# EAGLE design zgrzewarka3 - do szkoły (EAGLE 9.2.0)
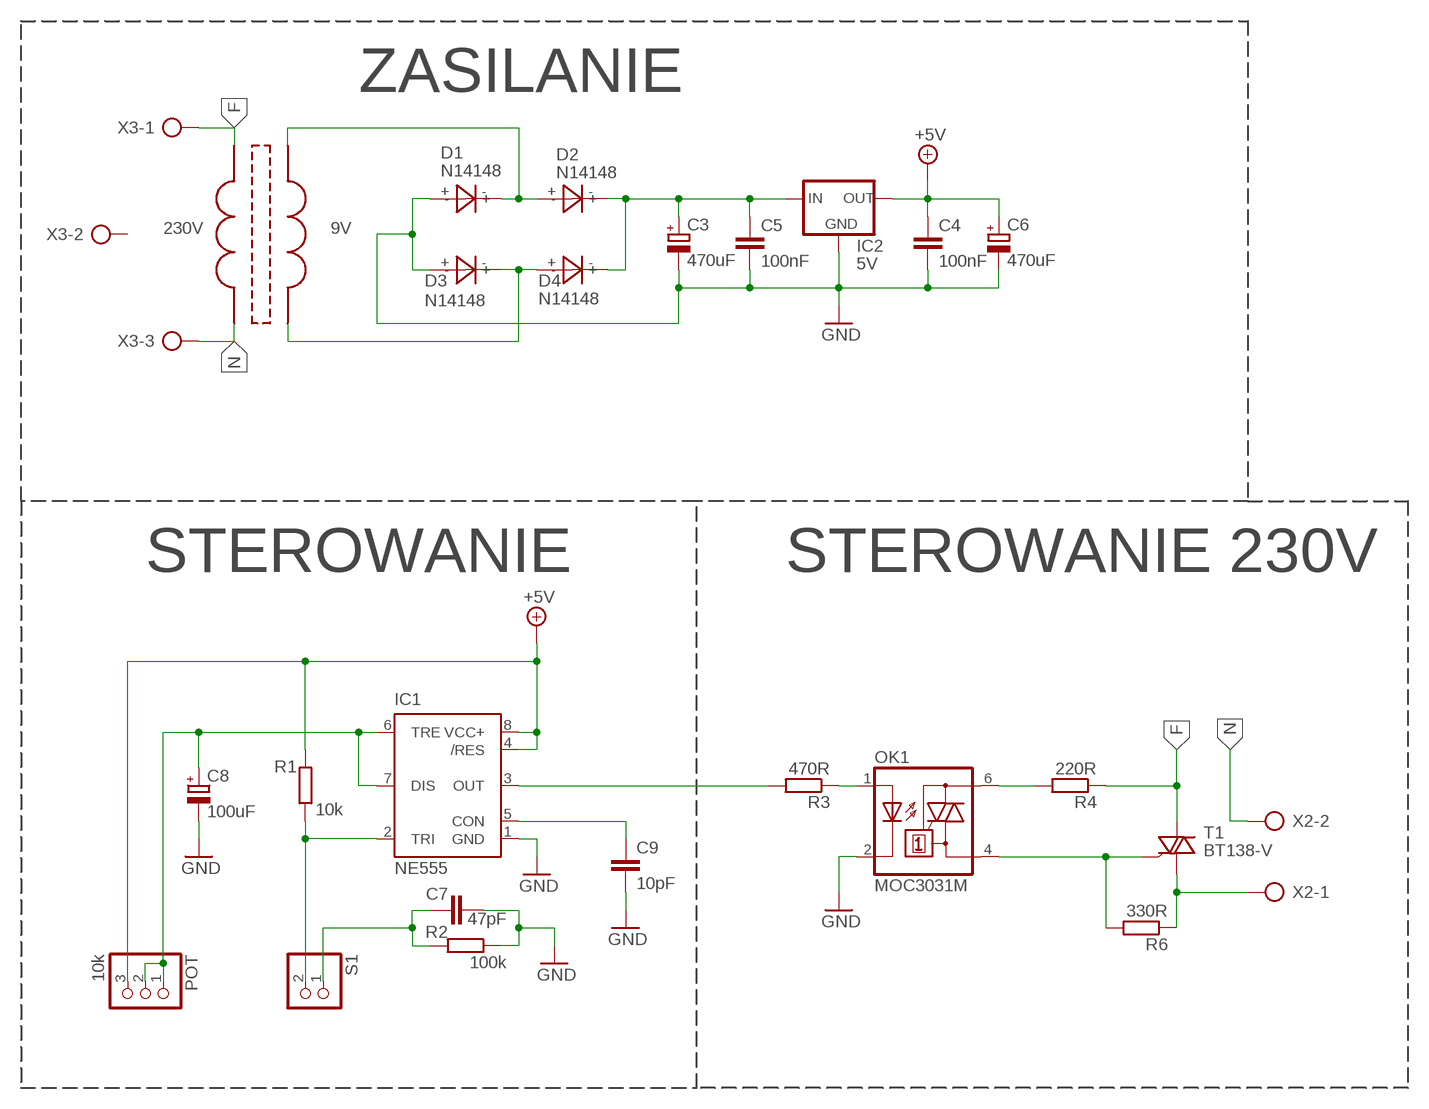
[diagram p0: schematic, sheet 1]

## Parts
C3  470uF  C-EU-POL'''  [C5-8,5]
C4  100nF  C-EU050-045-075  [C50-45-75]
C5  100nF  C-EU050-045-075  [C50-45-75]
C6  470uF  C-EU-POL'''  [C5-8,5]
C7  47pF  C-EU050-045-075  [C50-45-75]
C8  100uF  C-EU-POL'''  [C5-8,5]
C9  10pF  C-EU050-045-075  [C50-45-75]
D1  N14148  [DO35-7]
D2  N14148  [DO35-7]
D3  N14148  [DO35-7]
D4  N14148  [DO35-7]
IC1  NE555  [DIL-08]
IC2  5V  78LXX  [78LXX]
OK1  MOC3031M  [DIL06]
POT  10k  PINHD-1X3  [1X03]
R1  10k  R-EU7  [204/7]
R2  100k  R-EU7  [204/7]
R3  470R  R-EU7  [204/7]
R4  220R  R-EU7  [204/7]
R6  330R  R-EU7  [204/7]
S1  PINHD-1X2  [1X02]
T1  BT138-V  [TO220BV]
U$1  TRAFO-9V  [OBUDOWA1]
X2  AK300/2  [AK300/2]
X3  AK300/3  [AK300/3]

## Nets
+5V: C4.P$1 C6.+ IC1.4(/RES) IC1.8(VCC+) IC2.OUT POT.3 R1.P$2
F: R4.P$1 T1.T2(A2) U$1.230V-1 X3.1
GND: C3.- C4.P$2 C5.P$2 C6.- C7.P$2 C8.- C9.P$2 D1.+ D3.+ IC1.1(GND) IC2.GND OK1.2(C) R2.P$1
N: U$1.230V-2 X2.2 X3.3
N$2: C3.+ C5.P$1 D2.- D4.- IC2.IN
N$3: D1.- D2.+ U$1.9V-1
N$4: D3.- D4.+ U$1.9V-2
N$5: C9.P$1 IC1.5(CON)
N$7: IC1.2(TRI) R1.P$1 S1.2
N$8: IC1.3(OUT) R3.P$2
N$9: C7.P$1 R2.P$2 S1.1
N$10: OK1.1(A) R3.P$1
N$12: C8.+ IC1.6(TRE) IC1.7(DIS) POT.1 POT.2
N$13: OK1.6(A2) R4.P$2
N$14: OK1.4(A1) R6.P$2 T1.G
N$16: R6.P$1 T1.T1(A1) X2.1
Unconnected: X3.2

## Notes on the sheet
- ZASILANIE
- STEROWANIE | STEROWANIE 230V

## Library data of the parts
C3 C6 C8 = RCL!:C-EU-POL
C4 C5 C7 C9 = RCL!:C-EU
D1-D4 = Diody, mostki:N14148
IC1 = st-microelectronics:NE555: General purpose bipolar Timer; MF: Arrow Electronics; MPN: NE555N; OC_FARNELL: 1467742; OC_NEWARK: 89K1486
IC2 = v-reg:78LXX: VOLTAGE REGULATOR
OK1 = optocoupler:MOC30*: 6-Pin DIP Zero-Cross Optoisolators Triac Driver Output (250/400 Volt Peak) Source: Data sheet <http://www.fairchildsemi.com/ds/MO/MOC3031M.pdf> The old path of data sheet not more available 2013-05-06.; MF: FAIRCHILD SEMICONDUCTOR; MPN: MOC3031M; OC_FARNELL: 9875964; OC_NEWARK: 78K6089
POT = pinhead:PINHD-1X3: PIN HEADER
R1-R4 R6 = RCL!:R-EU
S1 = pinhead:PINHD-1X2: PIN HEADER
T1 = triac:BT138: TRIAC Source: http://www.semiconductors.philips.com BT138_SERIES_2.pdf
U$1 = trafo:TRAFO-9V
X2 = con-ptr500:AK300/2: CONNECTOR; OC_FARNELL: unknown; OC_NEWARK: unknown
X3 = con-ptr500:AK300/3: CONNECTOR; OC_FARNELL: unknown; OC_NEWARK: unknown

## Board
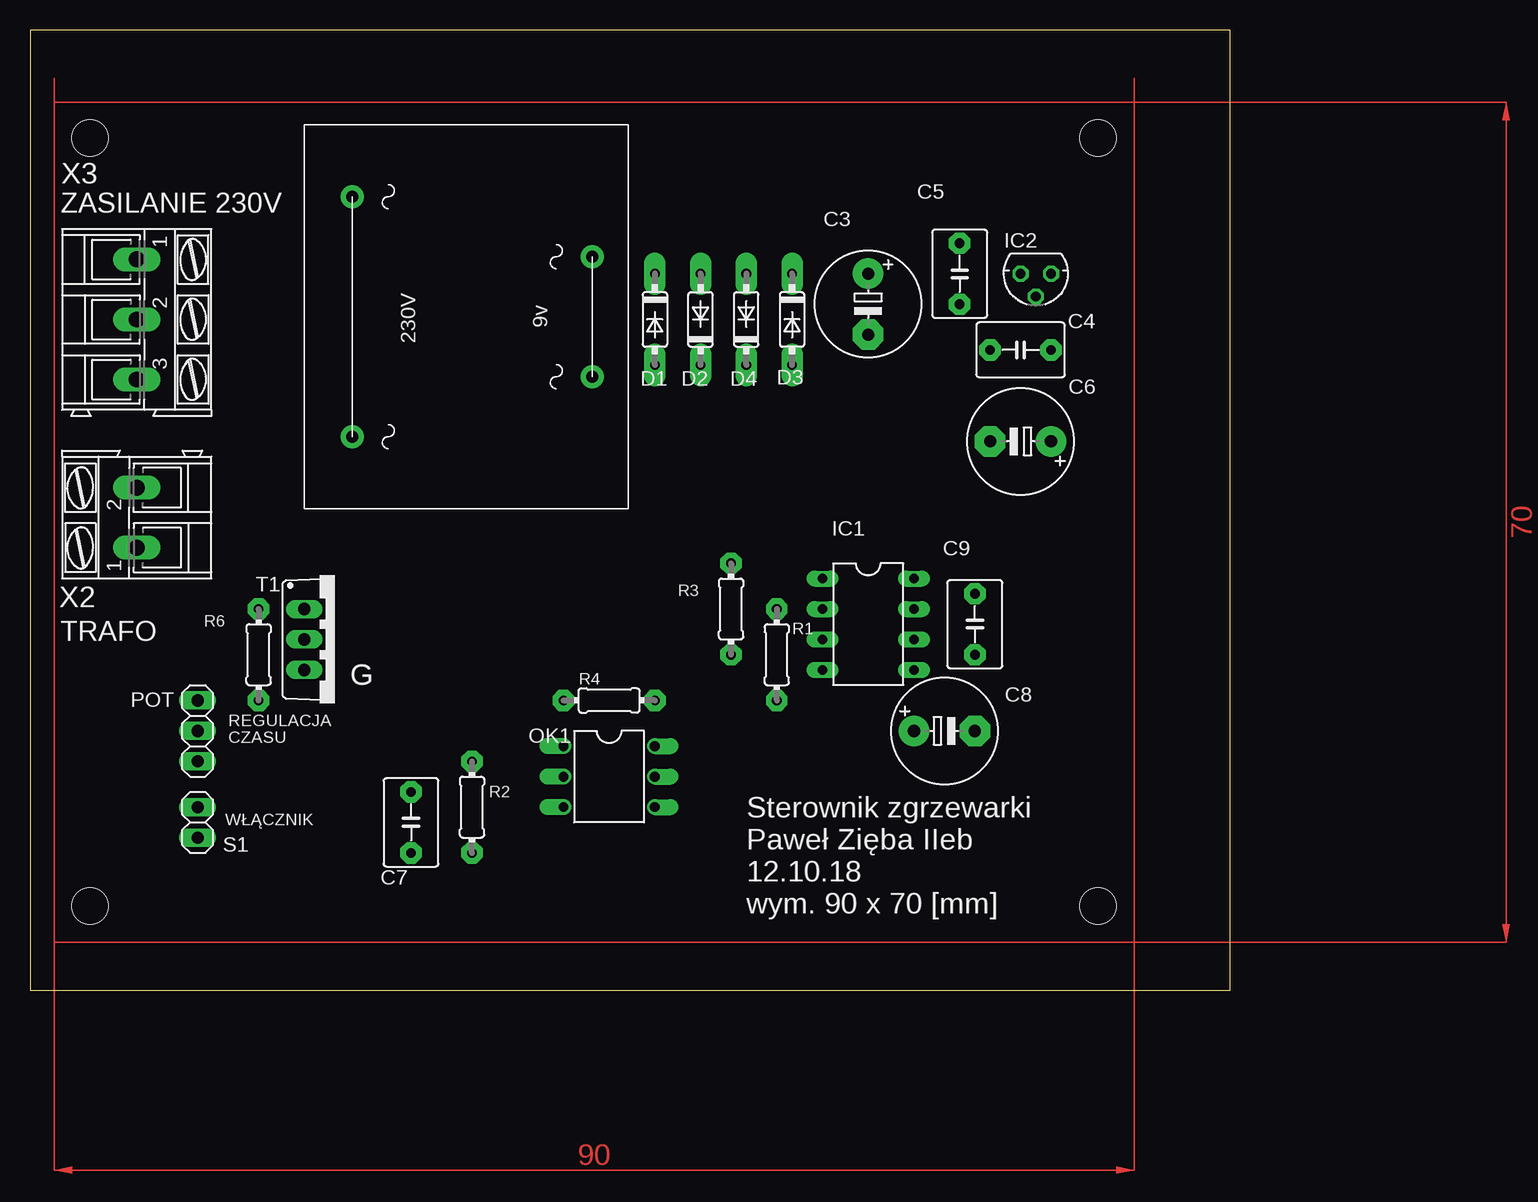
[diagram p1: board, top side]
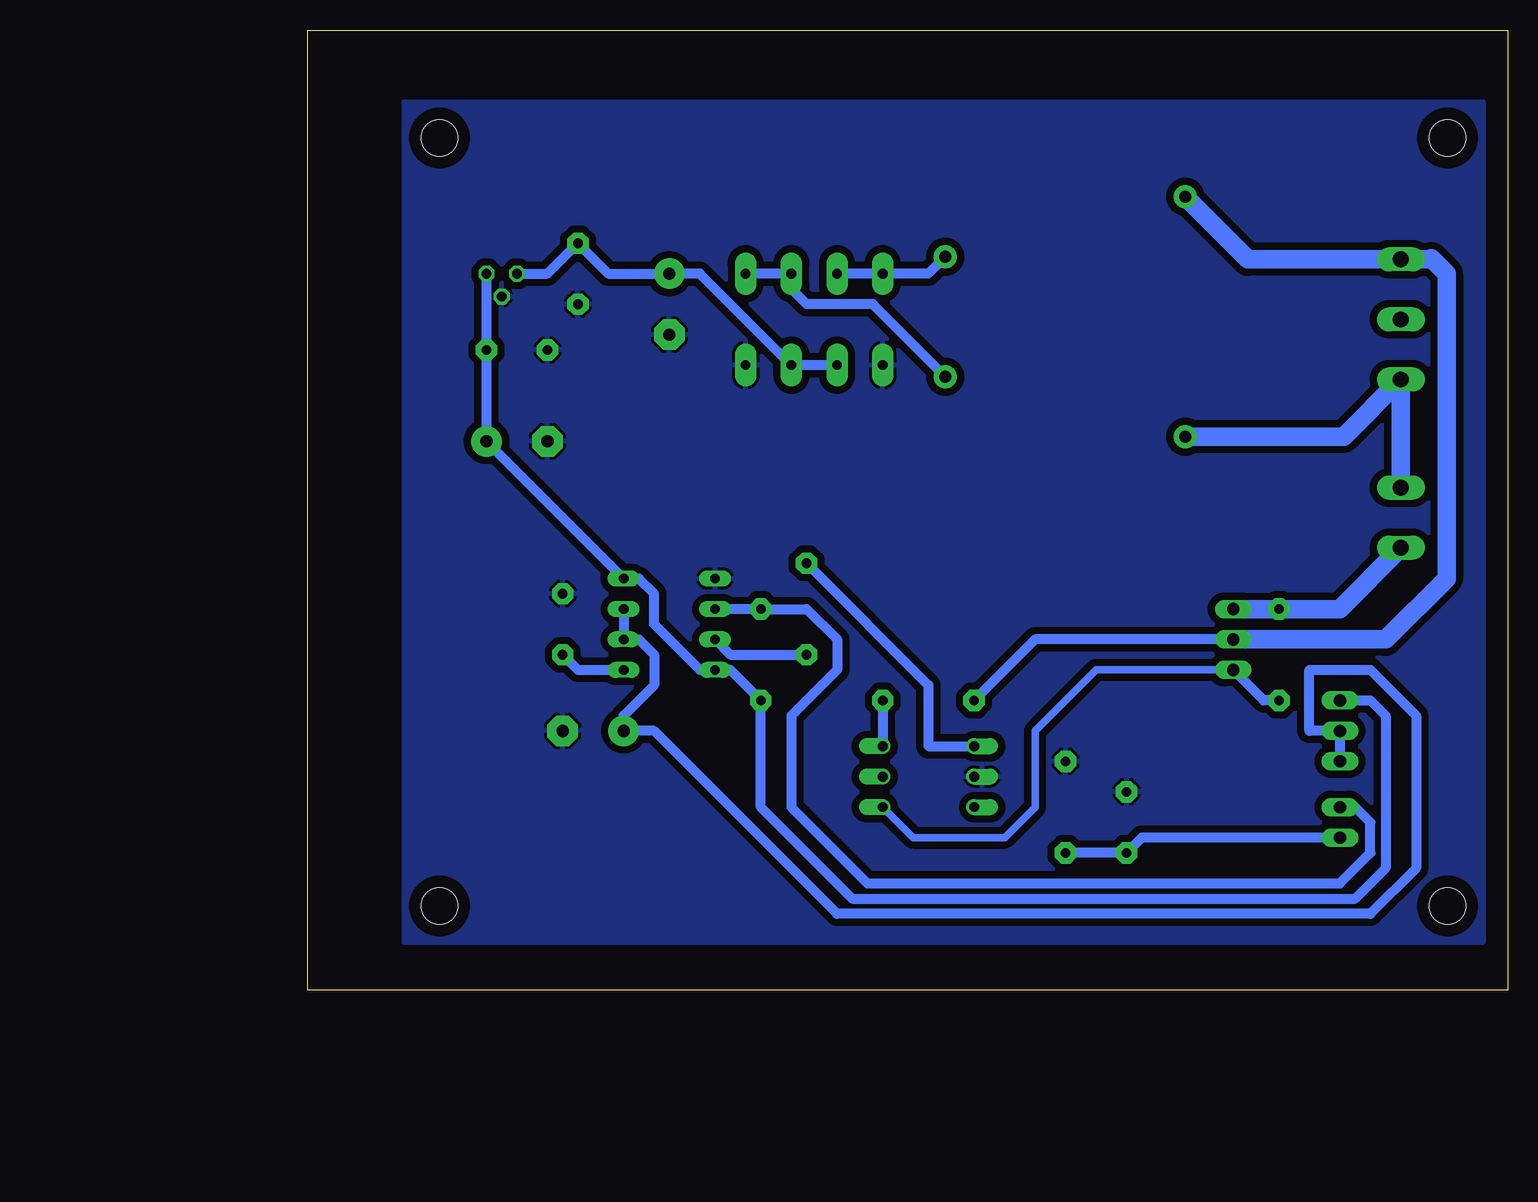
[diagram p2: board, bottom side, seen from below]

Size 100 x 80 mm. Coordinates in mm from the lower left corner, seen from the top.
Outline: 0,0 100,0 100,80 0,80 0,0
Copper layers (1*16): Top 0.035mm / dielectric 1.5mm / Bottom 0.035mm
Design rules "default": minimum track width 6mil, minimum drill 0.35mm, track to track 6mil, track to pad 6mil, pad to pad 6mil, via to via 6mil, smd to smd 6mil, copper to edge 40mil, drill to drill 6mil, minimum pad ring 10mil, minimum via ring 8mil, stop-mask expansion 4mil, vias tented up to drill 0mil, thermal gap 10mil
Holes 3 mm at 5,71 89,71 5,7 89,7

### Footprints (pad centres in the part's own frame; a part is rotated, then mirrored left to right if it is on the bottom)
C5-8,5 = drill 1.016 pad 2.54: + -2.54,0 | drill 1.016 pad 2.54 octagon: - 2.54,0
C50-45-75 = drill 0.8 pad 1.778 octagon: P$1 -2.54,0; P$2 2.54,0
DO35-7 = drill 0.8 pad 1.778 long: + 3.81,0; - -3.81,0
DIL-08 = drill 0.813 long: 1 -3.81,-3.81; 2 -1.27,-3.81; 3 1.27,-3.81; 4 3.81,-3.81; 5 3.81,3.81; 6 1.27,3.81; 7 -1.27,3.81; 8 -3.81,3.81
78LXX = drill 0.813 octagon: GND 0,1.905; IN 1.27,0; OUT -1.27,0
DIL06 = drill 0.813 offset: 1 -2.54,-3.81; 2 0,-3.81; 3 2.54,-3.81; 4 2.54,3.81; 5 0,3.81; 6 -2.54,3.81
1X03 = drill 1.016 long: 1 -2.54,0; 2 0,0; 3 2.54,0
204/7 = drill 0.8 pad 1.778 octagon: P$1 -3.81,0; P$2 3.81,0
1X02 = drill 1.016 long: 1 -1.27,0; 2 1.27,0
TO220BV = drill 1.016 long: G 2.54,-2.54; T1 -2.54,-2.54; T2 0,-2.54
OBUDOWA1 = drill 1 pad 1.93: 9V-1 11,24; 9V-2 21,24; 230V-1 6,4; 230V-2 26,4
AK300/2 = drill 1.321 long: 1 -2.515,0; 2 2.489,0
AK300/3 = drill 1.321 long: 1 -5.004,0; 2 0,0; 3 5.004,0

### Placement (x,y rotation side)
C3  69.85,57.15 270 top
C4  82.55,53.34 180 top
C5  77.47,59.69 270 top
C6  82.55,45.72 180 top
C7  31.75,13.97 90 top
C8  76.2,21.59 0 top
C9  78.74,30.48 90 top
D1  52.07,55.88 270 top
D2  55.88,55.88 90 top
D3  63.5,55.88 270 top
D4  59.69,55.88 90 top
IC1  69.85,30.48 270 top
IC2  83.82,59.69 180 top
OK1  48.26,17.78 270 top
POT  13.97,21.59 90 top
R1  62.23,27.94 270 top
R2  36.83,15.24 270 top
R3  58.42,31.75 270 top
R4  48.26,24.13 0 top
R6  19.05,27.94 270 top
S1  13.97,13.97 90 top
T1  25.4,29.21 270 top
U$1  22.86,72.11 270 top
X2  8.89,39.37 90 top
X3  8.89,55.88 270 top

### Tracks (layer width: path | path; a pad name or v marks a point on that pad's centre or on a via)
+5V
  Bottom 0.813: IC2.OUT C4.P$1 C6.+ IC1.8 72.39,34.29 71.12,33.02 71.12,30.48 67.31,26.67 IC1.4 64.77,26.67 R1.P$2 62.23,15.24 54.61,7.62 12.7,7.62 10.16,10.16 10.16,22.86 11.43,24.13 POT.3
F
  Bottom 0.813: R4.P$1 39.37,29.21 T1.T2
  Bottom 1.524: T1.T2 10.16,29.21 5.08,34.29 5.08,59.69 6.35,60.96 6.43,60.88 X3.1 21.63,60.88 U$1.230V-1
GND
  pour Bottom (isolate 0.61): 2,74 92,74 92,4 2,4
N
  Bottom 1.524: X2.2 X3.3 13.66,46.11 U$1.230V-2
N$2
  Bottom 0.813: IC2.IN 80.01,59.69 C5.P$1 74.93,59.69 C3.+ 67.31,59.69 D4.- D2.-
N$3
  Bottom 0.813: U$1.9V-1 48.28,59.69 D1.- D2.+
N$4
  Bottom 0.813: D3.- D4.+ 59.69,58.42 58.42,57.15 52.9,57.15 U$1.9V-2
N$5
  Bottom 0.813: C9.P$1 77.47,26.67 IC1.5
N$7
  Bottom 0.813: IC1.2 R1.P$1 58.42,31.75 55.88,29.21 55.88,26.67 59.69,22.86 59.69,15.24 53.34,8.89 13.97,8.89 11.43,11.43 11.43,13.97 12.7,15.24 S1.2
N$8
  Bottom 0.813: IC1.3 64.77,27.94 R3.P$2
N$9
  Bottom 0.813: R2.P$2 C7.P$1 30.48,12.7 S1.1
N$10
  Bottom 0.813: R3.P$1 48.26,25.4 48.26,20.32 OK1.1
N$12
  Bottom 0.813: IC1.7 IC1.6 72.39,29.21 71.12,27.94 71.12,25.4 73.66,22.86 C8.+ 71.12,21.59 55.88,6.35 11.43,6.35 7.62,10.16 7.62,22.86 11.43,26.67 16.51,26.67 16.51,21.59 POT.2 POT.1
N$13
  Bottom 0.813: R4.P$2 OK1.6
N$14
  Bottom 0.61: OK1.4 49.53,12.7 41.91,12.7 39.37,15.24 39.37,21.59 34.29,26.67 T1.G
  Bottom 0.813: R6.P$2 20.32,24.13 T1.G
N$16
  Bottom 1.524: T1.T1 R6.P$1 13.99,31.75 X2.1
(copper drawn outside any net)
  shapes: Top area x2

### Text on the board
tPlace: ZASILANIE 230V | TRAFO | G | REGULACJA | CZASU | WŁĄCZNIK | Sterownik zgrzewarki / Paweł Zięba IIeb / 12.10.18 / wym. 90 x 70 [mm]